# Altium schematic sheet hallpcb.SchDoc
size A4; SheetNumber: 1; SheetTotal: 1
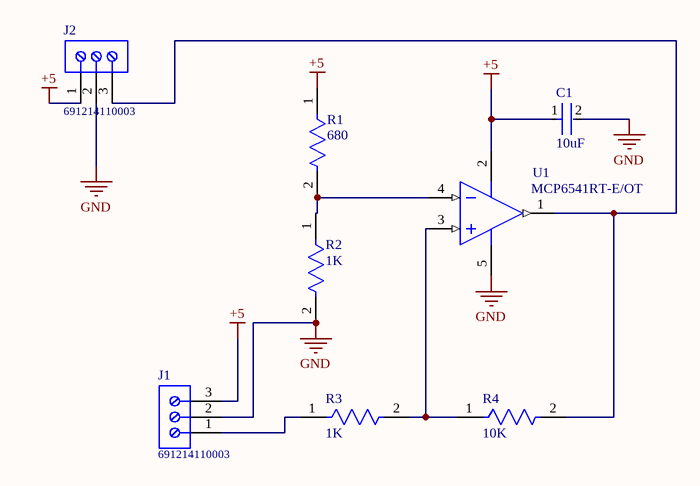
[diagram p0: hallpcb.SchDoc]

## Parts
C1  10uF  [FP-CC1206-1_25-MFG]
J1  691214110003  [691214110003]
J2  691214110003  [691214110003]
R1  680  [FP-CRCW1206-e3-IPC_C]
R2  1K  [FP-CRCW1206-e3-IPC_C]
R3  1K  [FP-CRCW1206-e3-IPC_C]
R4  10K  [FP-CRCW1206-e3-IPC_C]
U1  MCP6541RT-E/OT  [SOT-23-OT5_M]

## Nets
+5: C1.1 J1.3 J2.1 R1.1 U1.2(VDD)
GND: C1.2 J1.2 J2.2 R2.2 U1.5(VSS)
NetJ1_1: J1.1 R3.1
NetJ2_3: J2.3 R4.2 U1.1(OUT)
NetR1_2: R1.2 R2.1 U1.4(VIN-)
NetR3_2: R3.2 R4.1 U1.3(VIN+)

## Library data of the parts
C1 = CMP-03422-000842-1: CAP CER 0.1UF 50V X7R 1206; Manufacturer: Yageo; Manufacturer Part Number: CC1206KRX7R9BB104; Automotive Grade: NA; Value: 100 nF; Tolerance: 0.1; Material: Ceramic; Temperature Coefficient: 15%; Temperature Characteristic: X7R; Device Class L1: Passive Components; Lead Free: Yes; Octopart: https://octopart.com/cc1206krx7r9bb104-yageo-39467816; Category: Cap; Temperature Range Low: -55°C; Device Class L3: Ceramic Capacitors; Voltage Rating: 50 V; Temperature Range High: +125°C; Device Class L2: Capacitors; RoHS: TRUE; Package: CC1206-1.25; Footprint Url: http://www.yageo.com/exep/pages/download/literatures/UPY-C_GEN_24.pdf; ComponentLink2Description: Datasheet; Temperature: -55°C to +125°C; Capacitance: 100 nF; Digikey Description: CAP CER 0.1UF 50V X7R 1206; Height: 1.45mm; Automotive: No; Mouser Description: Multilayer Ceramic Capacitors MLCC - SMD/SMT 100nF 50V X7R 10%; ComponentLink2URL: http://www.yageo.com/documents/recent/UPY-NP0X7R_HV_1KV-to-3KV_11.pdf
J1 J2 = CMP-1502-02466-1: Serie 2141 - 3.50 mm Horizontal Entry Modular with Rising Cage Clamp WR-TBL, 3 pin; Manufacturer: Wurth Elektronik; Pin Number: 3; Pitch: 3.50mm; Package Reference: 691214110003; Mounting Technology: THT; Part Number: 691214110003; Manufacturer URL: http://www.we-online.de; Packaging: Box; Operating Temperature: -40to105degC; Publisher: WurthElektronik; Datasheet URL: http://katalog.we-online.de/em/datasheet/6912141100xx.pdf
R1-R4 = CMP-2003-04857-2: RES Thick Film, 0Ω, 0.25W, 1206; Resistance: 0mR; Power Rating: 250mW; Temperature Coefficient: 100ppm/°C; Tolerance: 1%; Voltage Rating (DC): 200V; Width: 1.6mm; Termination: SMD/SMT; Contact Plating: Tin; Min Operating Temperature: -55°C; Military Standard: Not; Mount: Surface Mount; Case Code (Metric): 3216; Case Code (Imperial): 1206; Packaging: Tape and Reel; Depth: 1.6mm; Case/Package: 1206; Radiation Hardening: No; Height: 0.55mm; Package Quantity: 5000; Weight: 0.000353oz; Max Operating Temperature: 155°C; Length: 3.2mm; Composition: Thick Film; Lead Free: Lead Free; Voltage Rating: 200V
U1 = CMP-0187-00774-2: None; Number of Channels: 1; Hysteresis: 6.5mV; Quiescent Current: 1uA; Max Input Current: 1pA; Supply Current: 600nA; Output Compatibility: CMOS; Common Mode Rejection Ratio: 70dB; Output Type: TTL; Natural Thermal Resistance: 256°C/W; Response Time: 4us; Input Offset Voltage (Vos): 7mV; Max Supply Voltage: 5.5V; Power Supply Rejection Ratio (PSRR): 80dB; Propagation Delay: 8us; Min Supply Voltage: 1.6V; Length: 3.1mm; Max Operating Temperature: 125°C; Input Bias Current: 1pA; Packaging: Tape and Reel; Mount: Surface Mount; Package Quantity: 3000; RoHS Compliant: Yes; Min Operating Temperature: -40°C; Radiation Hardening: No; Width: 1.8mm; Height: 1.3mm; Case/Package: SOT-23; Number of Elements: 1; Lead Free: Lead Free; Type: General Purpose; Number of Pins: 5; REACH SVHC: No SVHC; Technology: CMOS